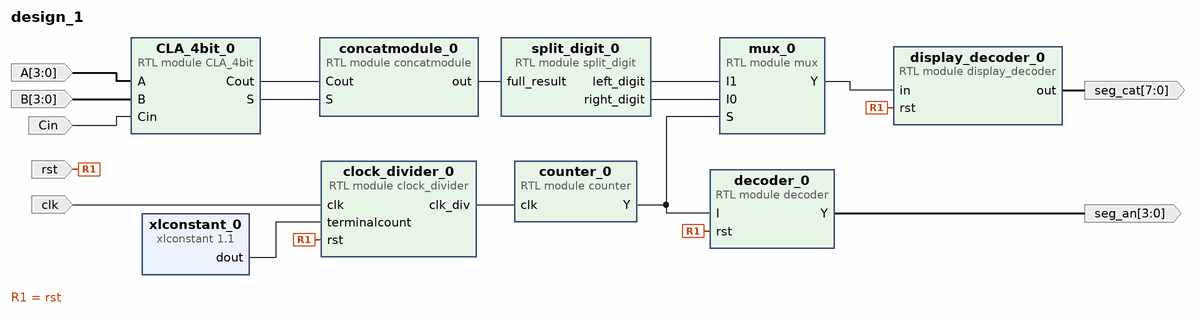
[diagram p0: block diagram of the top level]
# Vivado block design design_1, xc7z007sclg400-1, Vivado 2024.1.1
create_bd_design design_1

create_bd_port -dir I -from 3 -to 0 A
create_bd_port -dir I -from 3 -to 0 B
create_bd_port -dir I Cin
create_bd_port -dir I clk
create_bd_port -dir I rst
create_bd_port -dir O -from 7 -to 0 seg_cat
create_bd_port -dir O -from 3 -to 0 seg_an

create_bd_cell -type module -reference CLA_4bit CLA_4bit_0
create_bd_cell -type module -reference mux mux_0
create_bd_cell -type module -reference concatmodule concatmodule_0
create_bd_cell -type module -reference display_decoder display_decoder_0
create_bd_cell -type module -reference decoder decoder_0
create_bd_cell -type module -reference counter counter_0
create_bd_cell -type module -reference clock_divider clock_divider_0
create_bd_cell -type ip -vlnv xilinx.com:ip:xlconstant:1.1 xlconstant_0
set_property -dict {CONFIG.CONST_VAL 19999 CONFIG.CONST_WIDTH 17} [get_bd_cells xlconstant_0]
create_bd_cell -type module -reference split_digit split_digit_0

# ---- connections ----

connect_bd_net [get_bd_ports A] [get_bd_pins CLA_4bit_0/A]
connect_bd_net [get_bd_ports B] [get_bd_pins CLA_4bit_0/B]
connect_bd_net [get_bd_pins CLA_4bit_0/Cout] [get_bd_pins concatmodule_0/Cout]
connect_bd_net [get_bd_pins CLA_4bit_0/S] [get_bd_pins concatmodule_0/S]
connect_bd_net [get_bd_ports Cin] [get_bd_pins CLA_4bit_0/Cin]
connect_bd_net [get_bd_ports clk] [get_bd_pins clock_divider_0/clk]
connect_bd_net [get_bd_pins clock_divider_0/clk_div] [get_bd_pins counter_0/clk]
connect_bd_net [get_bd_pins concatmodule_0/out] [get_bd_pins split_digit_0/full_result]
connect_bd_net [get_bd_pins counter_0/Y] [get_bd_pins decoder_0/I] [get_bd_pins mux_0/S]
connect_bd_net [get_bd_pins decoder_0/Y] [get_bd_ports seg_an]
connect_bd_net [get_bd_pins display_decoder_0/out] [get_bd_ports seg_cat]
connect_bd_net [get_bd_pins mux_0/Y] [get_bd_pins display_decoder_0/in]
connect_bd_net [get_bd_ports rst] [get_bd_pins clock_divider_0/rst] [get_bd_pins decoder_0/rst] [get_bd_pins display_decoder_0/rst]
connect_bd_net [get_bd_pins split_digit_0/left_digit] [get_bd_pins mux_0/I1]
connect_bd_net [get_bd_pins split_digit_0/right_digit] [get_bd_pins mux_0/I0]
connect_bd_net [get_bd_pins xlconstant_0/dout] [get_bd_pins clock_divider_0/terminalcount]

validate_bd_design
save_bd_design
